# EAGLE design 230V_AC_Switch (EAGLE 6.3)
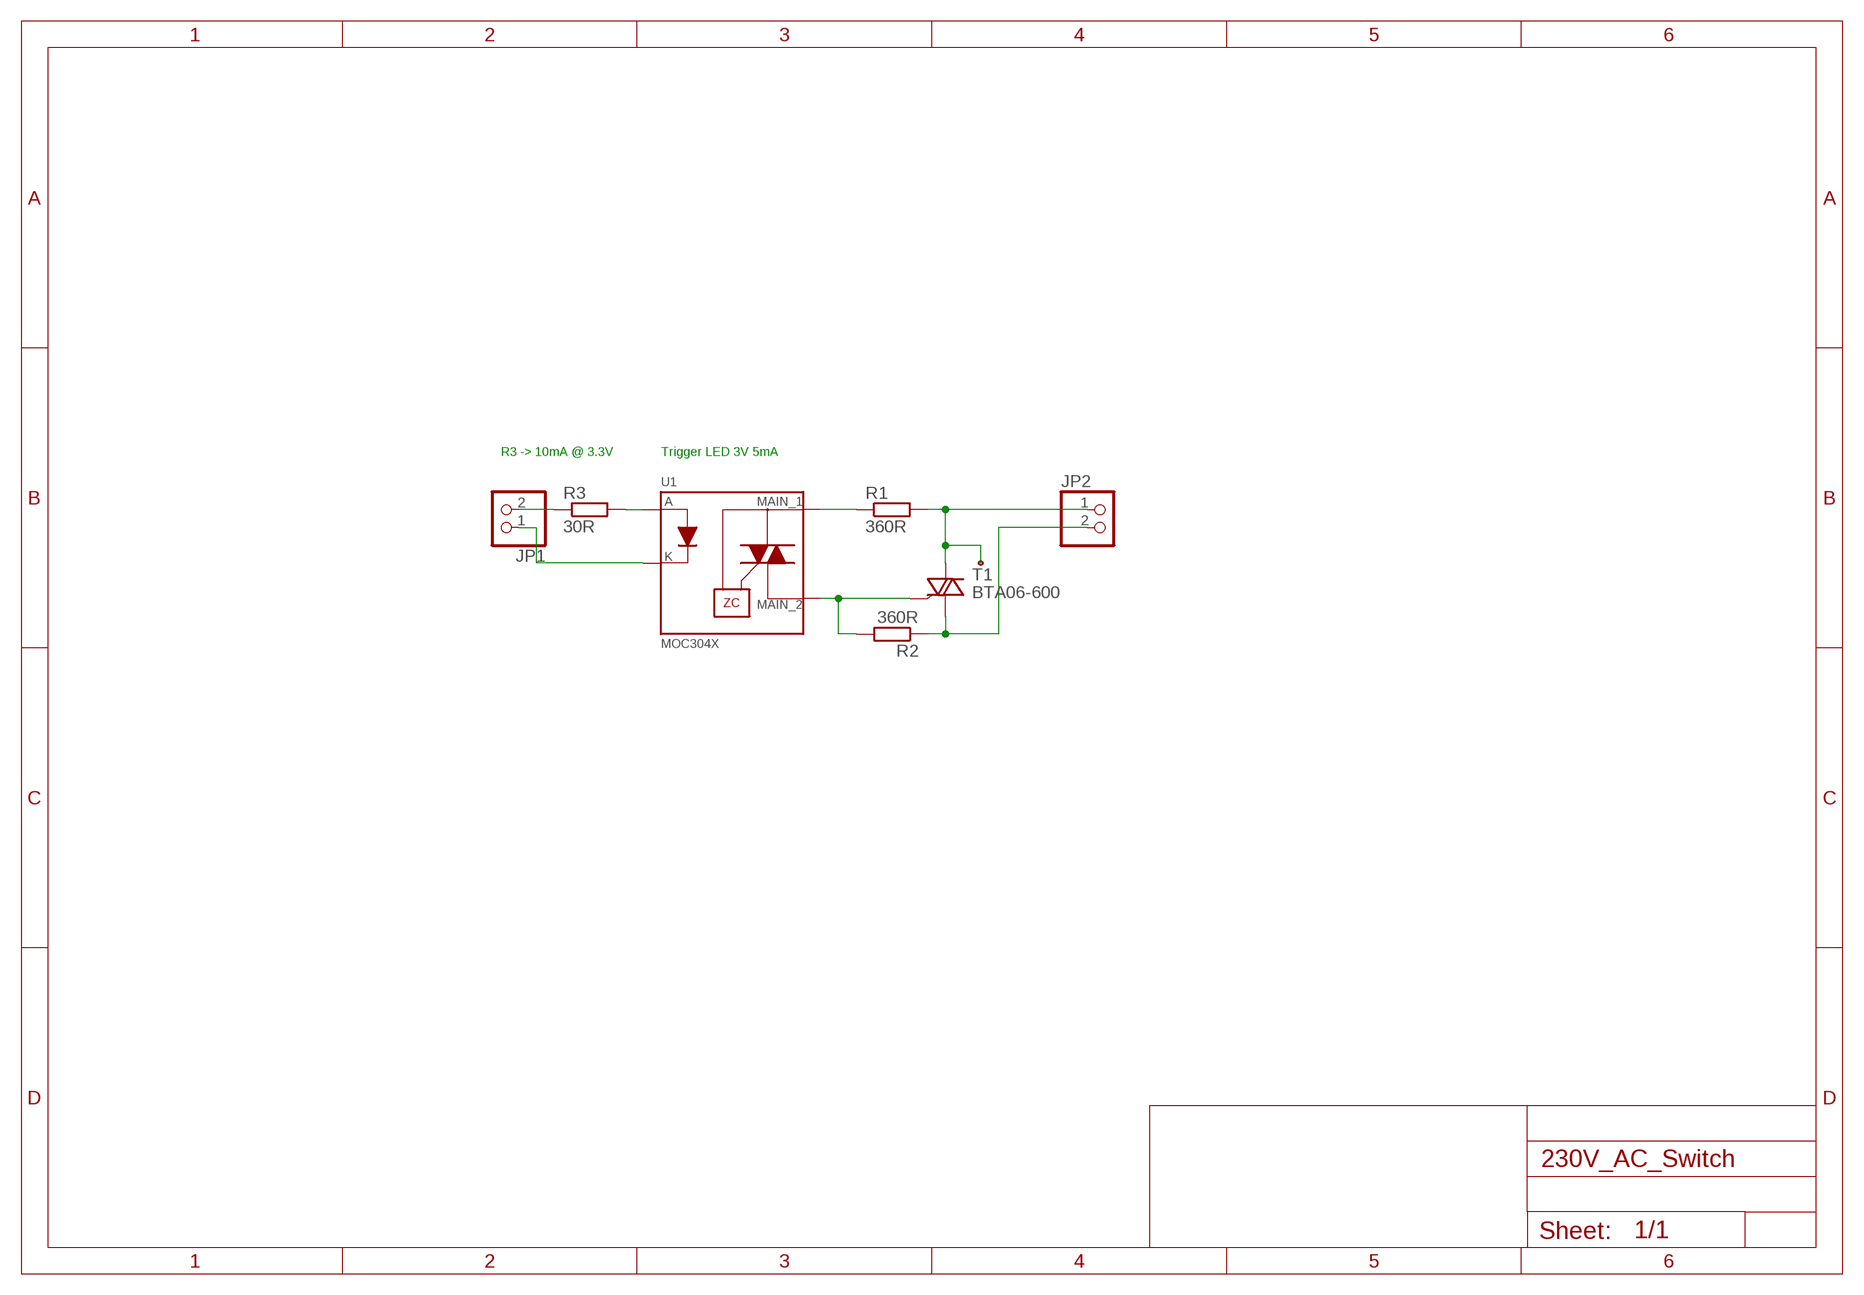
[diagram p0: schematic, sheet 1]

## Parts
JP1  PINHD-1X2  [1X02]
JP2  PINHD-1X2  [1X02]
R1  360R  R-EU_R1206  [R1206]
R2  360R  R-EU_R1206  [R1206]
R3  30R  R-EU_R0603  [R0603]
T1  BTA06-600  [TO220AB]
U1  MOC304X  [PDIP]

## Nets
EN_+: JP1.2 R3.1
EN_-: JP1.1 U1.2(K)
N$1: R2.2 T1.3(G) U1.4(MAIN_2)
N$2: R1.1 U1.6(MAIN_1)
N$4: R3.2 U1.1(A)
OUT: JP2.2 R2.1 T1.1(A1)
VAC: JP2.1 R1.2 T1.2(A2) T1.PAD

## Notes on the sheet
- R3 -> 10mA @ 3.3V | Trigger LED 3V 5mA

## Library data of the parts
JP1 JP2 = pinhead:PINHD-1X2: PIN HEADER
R1-R3 = rcl:R-EU_: RESISTOR, European symbol
T1 = STMicroelectronics:BTA06-600: TRIAC; DISTRIBUTOR: RS; ORDER_CODE: 714-2558
U1 = fairchild:MOC304X; DISTRIBUTOR: RS; ORDER_CODE: 671-2752

## Board
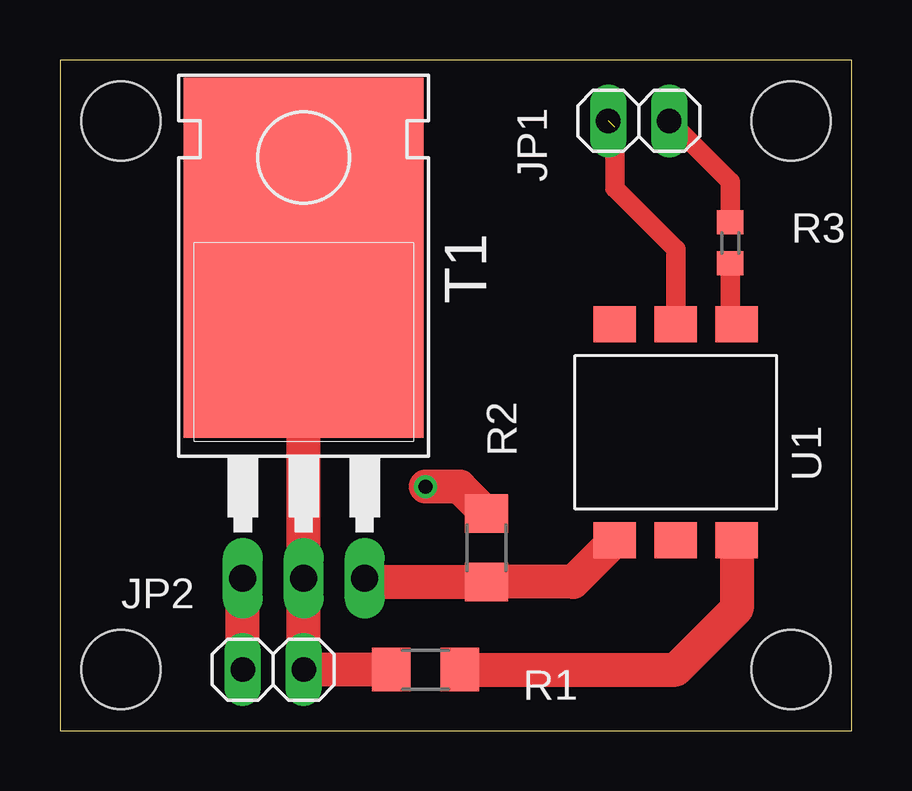
[diagram p1: board, top side]
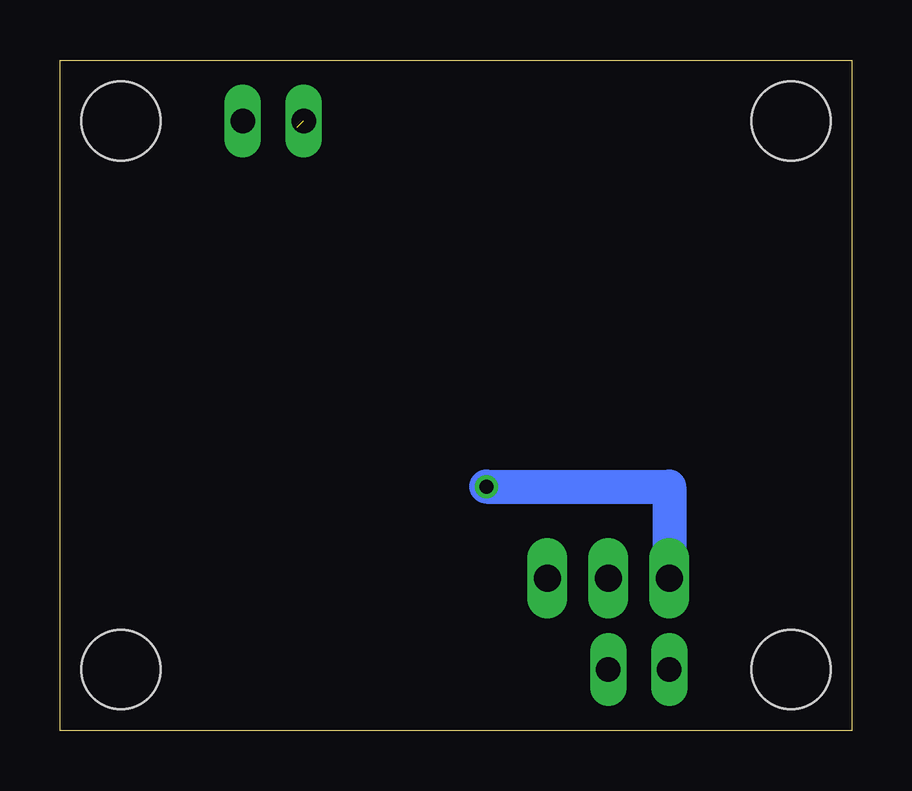
[diagram p2: board, bottom side, seen from below]

Size 33.02 x 27.94 mm. Coordinates in mm from the lower left corner, seen from the top.
Outline: 0,0 33.02,0 33.02,27.94 0,27.94 0,0
Copper layers (1*16): Top 0.0356mm / dielectric 1.5011mm / Bottom 0.0356mm
Design rules "oshPark2Layer": minimum track width 6mil, minimum drill 13mil, track to track 6mil, track to pad 6mil, pad to pad 6mil, via to via 6mil, smd to smd 6mil, copper to edge 15mil, drill to drill 6mil, minimum pad ring 7mil, minimum via ring 7mil, stop-mask expansion 3mil, vias tented up to drill 0mil, thermal gap 10mil
Holes 3.3 mm at 2.54,25.4 2.54,2.54 30.48,25.4 30.48,2.54

### Footprints (pad centres in the part's own frame; a part is rotated, then mirrored left to right if it is on the bottom)
1X02 = drill 1.016 long: 1 -1.27,0; 2 1.27,0
R1206 = smd 1.6 x 1.803: 1 -1.422,0; 2 1.422,0
R0603 = smd 1 x 1.1: 1 -0.85,0; 2 0.85,0
TO220AB = drill 1.118 long: 1 -2.54,-6.35; 2 0,-6.35; 3 2.54,-6.35 | smd 10 x 15: PAD 0,7
PDIP = smd 1.78 x 1.52: 1 -2.54,-4.5; 2 0,-4.5; 3 2.54,-4.5; 4 2.54,4.5; 5 0,4.5; 6 -2.54,4.5

### Placement (x,y rotation side)
JP1  24.13,25.4 0 top
JP2  8.89,2.54 180 top
R1  15.24,2.54 180 top
R2  17.78,7.62 270 top
R3  27.94,20.32 270 top
T1  10.16,12.7 0 top
U1  25.67,12.43 180 top

### Tracks (layer width: path | path; a pad name or v marks a point on that pad's centre or on a via)
EN_+
  Top 0.813: JP1.2 27.94,22.86 R3.1
EN_-  (1 unrouted)
  Top 0.813: 23.13,25.13 23.13,22.59 25.67,20.05 U1.2
N$1
  Top 1.422: U1.4 21.4,6.2 R2.2 12.85,6.2 T1.3
N$2
  Top 1.422: R1.1 25.67,2.54 28.21,5.08 U1.6
N$4
  Top 0.813: R3.2 27.94,16.93 U1.1
OUT  (via drill 0.6)
  Top 1.422: JP2.2 T1.1 | R2.1 16.66,10.16 v15.24,10.16
  Bottom 1.422: v15.24,10.16 7.62,10.16 T1.1
VAC
  Top 1.422: T1.PAD T1.2 JP2.1 R1.2